# Altium schematic sheet PowerSupply.SchDoc: Power Board
size Tabloid; Date: 12/20/2022; Engineer: Terry D. Schevker; Revision: 1.0; SheetNumber: 5; SheetTotal: 8
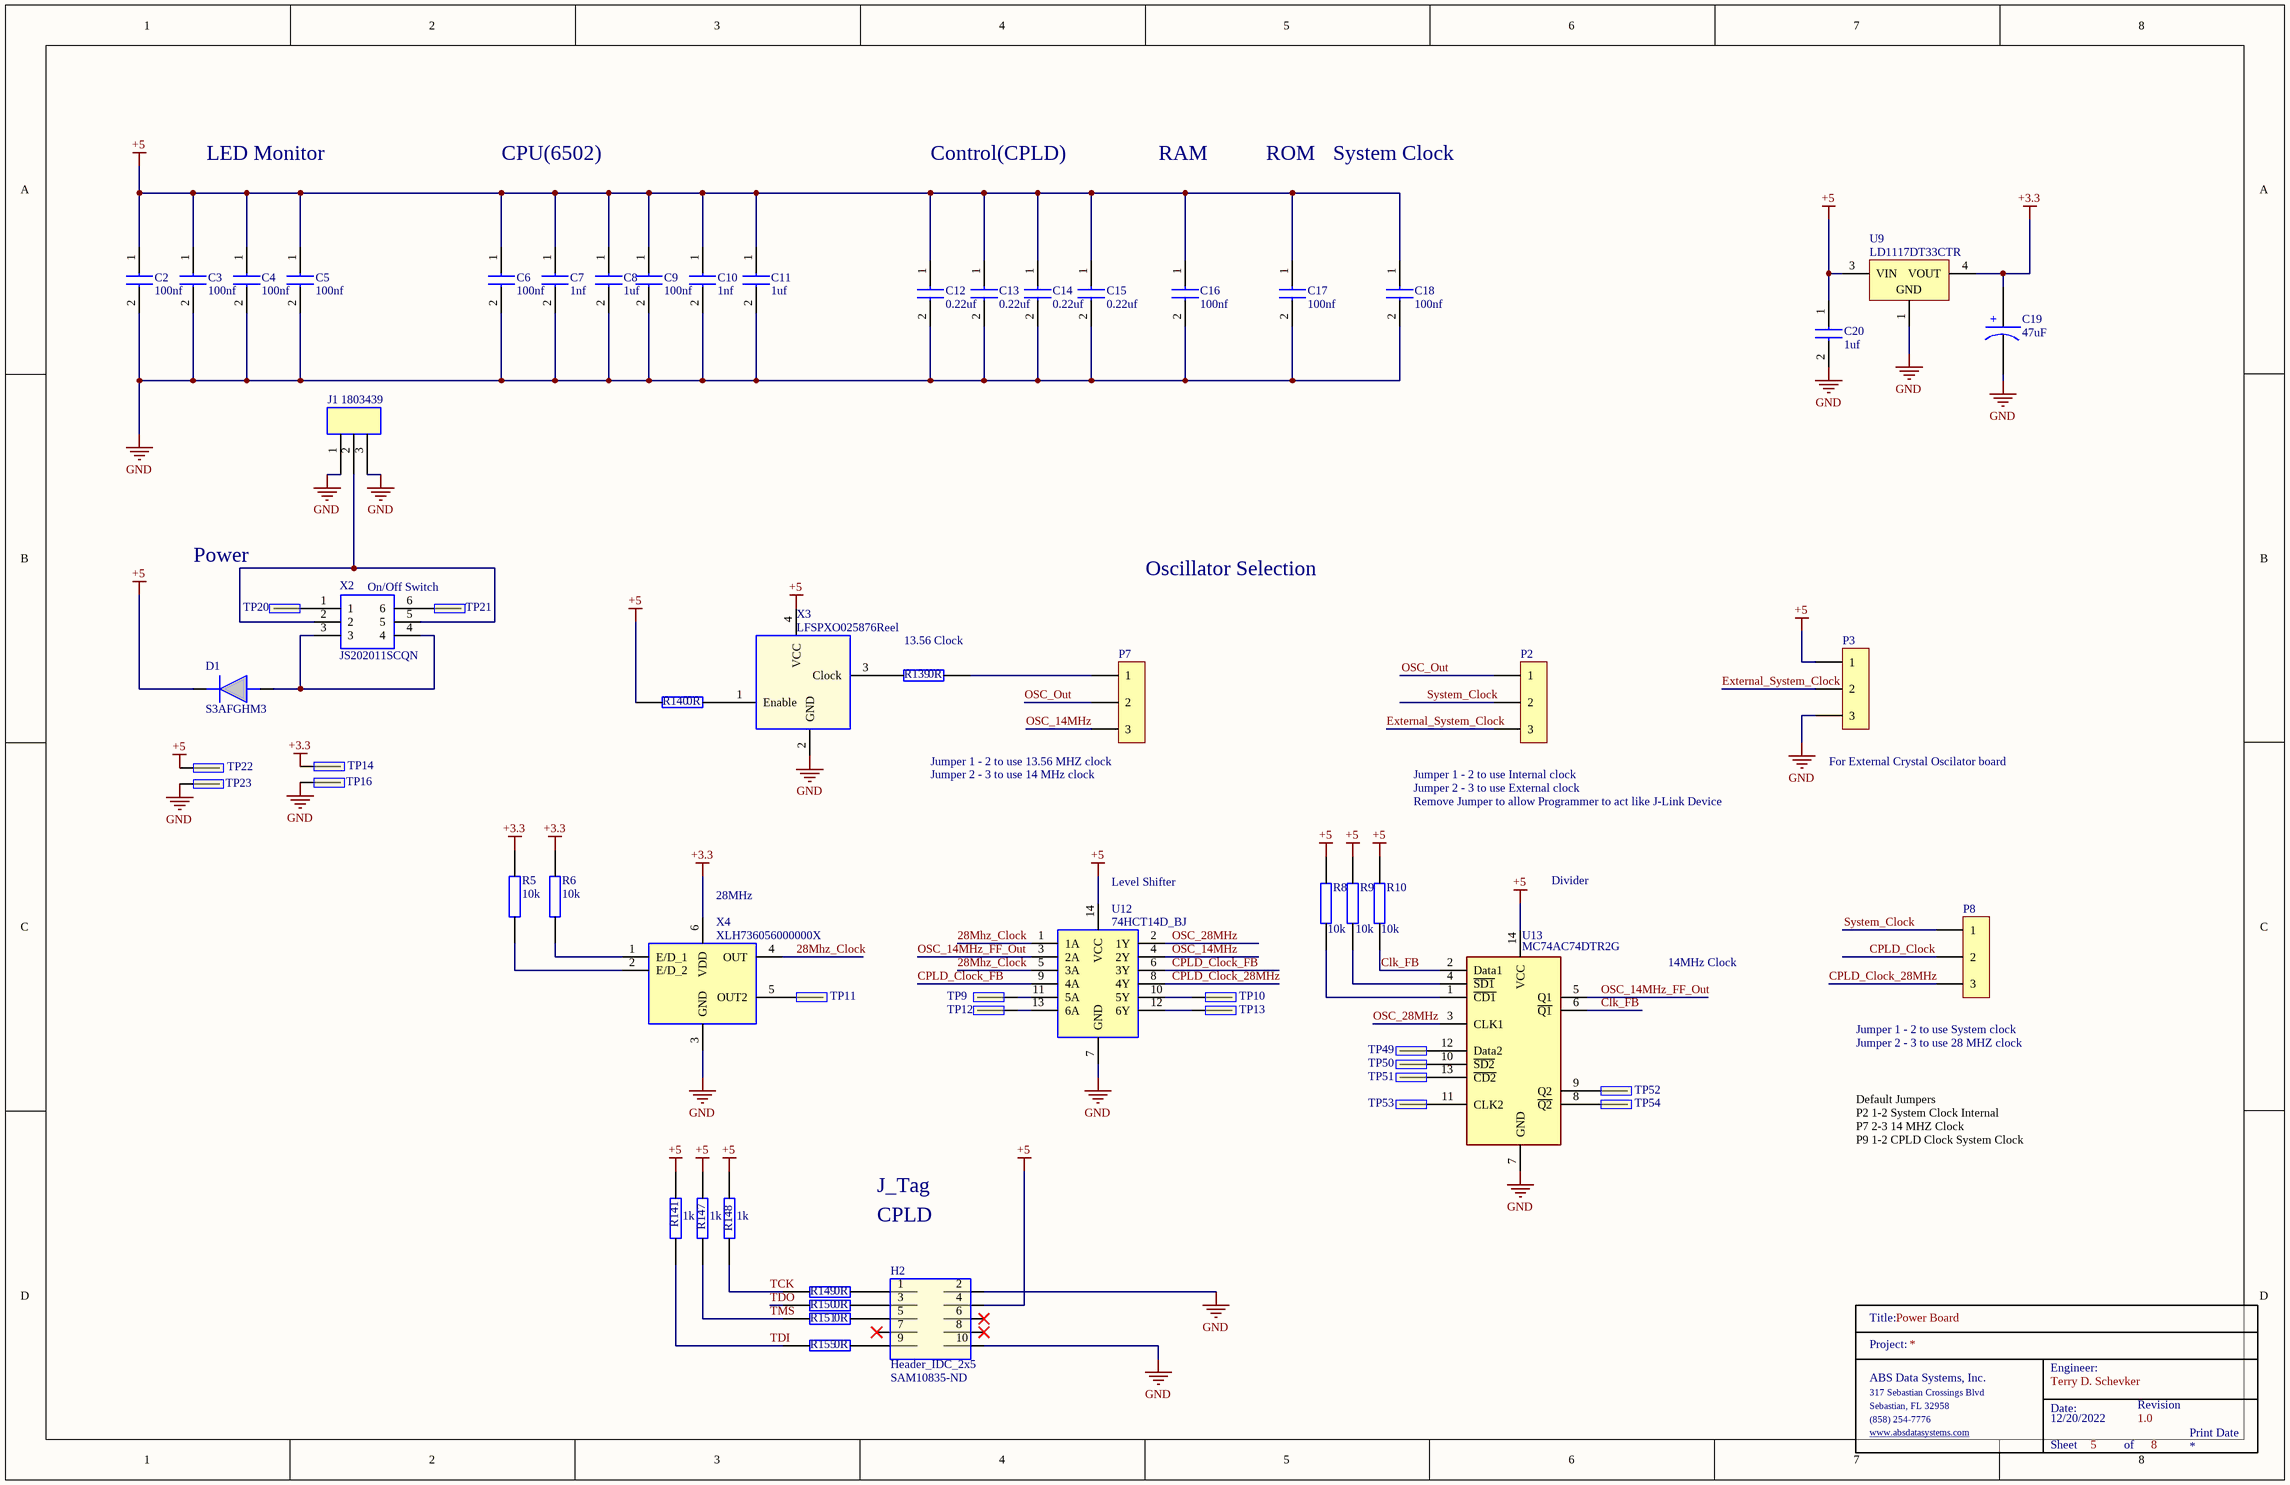
[diagram p0: PowerSupply.SchDoc]

## Parts
C2  100nf  [0603]
C3  100nf  [0603]
C4  100nf  [0603]
C5  100nf  [0603]
C6  100nf  [0603]
C7  1nf  [0603]
C8  1uf  [0603]
C9  100nf  [0603]
C10  1nf  [0603]
C11  1uf  [0603]
C12  0.22uf  [0603]
C13  0.22uf  [0603]
C14  0.22uf  [0603]
C15  0.22uf  [0603]
C16  100nf  [0603]
C17  100nf  [0603]
C18  100nf  [0603]
C19  47uF  [CapSMD_6.3x5.8]
C20  1uf  [0603]
D1  S3AFGHM3  [do-221ac]
H2  Header_IDC_2x5  Supplier Part Number 1: SAM10835-ND  [HDR2X5]
J1  1803439  [1803439]
P2  MHDR1X3_100  [MHDR1X3_100]  (value not drawn)
P3  MHDR1X3_100  [MHDR1X3_100]  (value not drawn)
P7  MHDR1X3_100  [MHDR1X3_100]  (value not drawn)
P8  MHDR1X3_100  [MHDR1X3_100]  (value not drawn)
R5  10k  [0603]
R6  10k  [0603]
R8  10k  [0603]
R9  10k  [0603]
R10  10k  [0603]
R139  0R  [0603]
R140  0R  [0603]
R141  1k  [0603]
R147  1k  [0603]
R148  1k  [0603]
R149  0R  [0603]
R150  0R  [0603]
R151  0R  [0603]
R155  0R  [0603]
TitleBlock_3  TitleBlock  (value not drawn)  (graphical)
TP9  (no value)  [TP]
TP10  TP  [TP]  (value not drawn)
TP11  TP  [TP]  (value not drawn)
TP12  (no value)  [TP]
TP13  TP  [TP]  (value not drawn)
TP14  TP  [TP]  (value not drawn)
TP16  TP  [TP]  (value not drawn)
TP20  (no value)  [TP]
TP21  (no value)  [TP]
TP22  TP  [TP]  (value not drawn)
TP23  TP  [TP]  (value not drawn)
TP49  TP  [TP]  (value not drawn)
TP50  TP  [TP]  (value not drawn)
TP51  TP  [TP]  (value not drawn)
TP52  TP  [TP]  (value not drawn)
TP53  TP  [TP]  (value not drawn)
TP54  TP  [TP]  (value not drawn)
U9  LD1117DT33CTR  [TO-252_N]
U12  74HCT14D_BJ  [SOIC127P600X175-14N]
U13  MC74AC74DTR2G  [SOP65P640X120-14N]
X2  JS202011SCQN  [JS202011SCQN]
X3  LFSPXO025876Reel  [LFSPXO025876Reel]
X4  XLH736056000000X  [XLH736056000000X]

## Nets
+3.3: C19.1 R5.2 R6.2 TP14.1 U9.4(VOUT) X4.6(VDD)
+5: C2.1 C3.1 C4.1 C5.1 C6.1 C7.1 C8.1 C9.1 C10.1 C11.1 C12.1 C13.1 C14.1 C15.1 C16.1 C17.1 C18.1 C20.1 D1.1(K) H2.4 P3.1 R8.2 R9.2 R10.2 R140.1 R141.1 R147.1 R148.1 TP22.1 U9.3(VIN) U12.14(VCC) U13.14(VCC) X3.4(VCC)
GND: C2.2 C3.2 C4.2 C5.2 C6.2 C7.2 C8.2 C9.2 C10.2 C11.2 C12.2 C13.2 C14.2 C15.2 C16.2 C17.2 C18.2 C19.2 C20.2 H2.2 H2.10 J1.1 J1.3 P3.3 TP16.1 TP23.1 U9.1(GND) U12.7(GND) U13.7(GND) X3.2(GND) X4.3(GND)
28Mhz_Clock: U12.1(1A) U12.5(3A) X4.4(OUT)
Clk_FB: R10.1 U13.2(Data1) U13.6(~{Q1})
CPLD_Clock: P8.2
CPLD_Clock_28MHz: P8.3 U12.8(4Y)
CPLD_Clock_FB: U12.6(3Y) U12.9(4A)
External_System_Clock: P2.3 P3.2
OSC_14MHz: P7.3 U12.4(2Y)
OSC_14MHz_FF_Out: U12.3(2A) U13.5(Q1)
OSC_28MHz: U12.2(1Y) U13.3(CLK1)
OSC_Out: P2.1 P7.2
System_Clock: P2.2 P8.1
TCK: R148.2 R149.1
TDI: R141.2 R155.1
TDO: R150.1
TMS: R147.2 R151.1
NetD1_2: D1.2(A) X2.3 X2.4
NetH2_1: H2.1 R149.2
NetH2_3: H2.3 R150.2
NetH2_5: H2.5 R151.2
NetH2_9: H2.9 R155.2
NetJ1_2: J1.2 X2.2 X2.5
NetP7_1: P7.1 R139.2
NetR5_1: R5.1 X4.2(E/D_2)
NetR6_1: R6.1 X4.1(E/D_1)
NetR8_1: R8.1 U13.1(~{CD1})
NetR9_1: R9.1 U13.4(~{SD1})
NetR139_1: R139.1 X3.3(Clock)
NetR140_2: R140.2 X3.1(Enable)
NetTP9_1: TP9.1 U12.11(5A)
NetTP10_1: TP10.1 U12.10(5Y)
NetTP11_1: TP11.1 X4.5(OUT2)
NetTP12_1: TP12.1 U12.13(6A)
NetTP13_1: TP13.1 U12.12(6Y)
NetTP20_1: TP20.1 X2.1
NetTP21_1: TP21.1 X2.6
NetTP49_1: TP49.1 U13.12(Data2)
NetTP50_1: TP50.1 U13.10(~{SD2})
NetTP51_1: TP51.1 U13.13(~{CD2})
NetTP52_1: TP52.1 U13.9(Q2)
NetTP53_1: TP53.1 U13.11(CLK2)
NetTP54_1: TP54.1 U13.8(~{Q2})

Not connected (* = marked no-connect by the designer): H2 6* 7* 8*

## Notes on the sheet
- LED Monitor
- CPU(6502)
- Control(CPLD)
- RAM
- ROM
- System Clock
- (near TP20) Power
- On/Off Switch
- Oscillator Selection
- (near R139) 13.56 Clock
- (near P7) Jumper 1 - 2 to use 13.56 MHZ clock
- (near P3) For External Crystal Oscilator board
- (near P7) Jumper 2 - 3 to use 14 MHz clock
- (near P2) Jumper 1 - 2 to use Internal clock
- Remove Jumper to allow Programmer to act like J-Link Device
- Jumper 2 - 3 to use External clock
- (near X4) 28MHz
- (near U12) Level Shifter
- Divider
- 14MHz Clock
- (near P8) Jumper 1 - 2 to use System clock
- Jumper 2 - 3 to use 28 MHZ clock
- Default Jumpers
  P2 1-2 System Clock Internal
  P7 2-3 14 MHZ Clock
  P9 1-2 CPLD Clock System Clock
- J_Tag
- CPLD
- Print Date
- (in symbol TitleBlock) Title:; Project:; Engineer:; ABS Data Systems, Inc.; 317 Sebastian Crossings Blvd; Sebastian, FL 32958; Date:; Revision; (858) 254-7776; www.absdatasystems.com; Sheet; of
- (in symbol UUD1C470MCL1GS) +

## Library data of the parts
C2-C6 C9 C12-C18 = CL10B104JB8NNNC: Samsung Electro-Mechanics 0603 100nf
C7 C10 = CL10B102KB8NNNL: Samsung Electro-Mechanics 0603 1nf
C8 C11 C20 = CL10B105KA8NNNL: Samsung Electro-Mechanics 0603 1uf
C19 = UUD1C470MCL1GS: CAP ALUM 47UF 20% 16V SMD; Manufacturer: Nichicon; Dielectric Material: Aluminium; Ripple Current: 230mA; Impedance: 440mR; Leakage Current: 3uA; Life (Hours): 2000Hour; Dissipation Factor: 0.2%; Lead Diameter: 0.8mm; Supplier 1: Digi-Key; Manufacturer Part Number: UUD1C470MCL1GS; RoHS: Yes; Category: Aluminum Electrolytic Capacitors; Stock 1: 26327; Pricing 1: 1=0.50000, 10=0.34600, 50=0.24220, 100=0.20760, 500=0.15568 (USD); Case/Package: Radial; Number of Pins: 2; Contact Plating: Tin; Min Operating Temperature: -55°C; Max Operating Temperature: 105°C; Tolerance: 20%; Capacitance: 47uF; Package Quantity: 1000; Voltage Rating (DC): 16V; Packaging: Tape and Reel; Voltage Rating: 16V; Ripple Current (AC): 230mA; Termination: SMD/SMT; Voltage: 16V; Diameter: 6.3mm; Length: 5.8mm; Height: 5.8mm; Lead Pitch: 2.2mm; Height - Seated (Max): 0.228inch; Radiation Hardening: No; REACH SVHC: No SVHC; Lead Free: Lead Free; ComponentLink1URL: https://datasheet.ciiva.com/30522/getdatasheetpartid-449848-30522051.pdf?src-supplier=Verical; ComponentLink1Description: https://datasheet.ciiva.com/30522/getdatasheetpartid-449848-30522051.pdf?src-supplier=Verical; ComponentLink2URL: https://datasheet.ciiva.com/96/e-ud-96997.pdf?src-supplier=Digi-Key; ComponentLink2Description: https://datasheet.ciiva.com/96/e-ud-96997.pdf?src-supplier=Digi-Key; ComponentLink3URL: https://datasheet.ciiva.com/11776/0900766b80fa39e7-11776889.pdf?src-supplier=RSComponents; ComponentLink3Description: https://datasheet.ciiva.com/11776/0900766b80fa39e7-11776889.pdf?src-supplier=RSComponents; ComponentLink4URL: https://datasheet.ciiva.com/96/e-ud-96998.pdf?src-supplier=Digi-Key; ComponentLink4Description: https://datasheet.ciiva.com/96/e-ud-96998.pdf?src-supplier=Digi-Key; ComponentLink5URL: https://datasheet.ciiva.com/96/e-ud-96999.pdf?src-supplier=Digi-Key; ComponentLink5Description: https://datasheet.ciiva.com/96/e-ud-96999.pdf?src-supplier=Digi-Key; ComponentLink6URL: https://datasheet.ciiva.com/11686/e-ud-11686236.pdf?src-supplier=Avnet; ComponentLink6Description: https://datasheet.ciiva.com/11686/e-ud-11686236.pdf?src-supplier=Avnet; ComponentLink7URL: https://datasheet.ciiva.com/16502/e-ud-16502750.pdf?src-supplier=Future+Electronics; ComponentLink7Description: https://datasheet.ciiva.com/16502/e-ud-16502750.pdf?src-supplier=Future+Electronics; ComponentLink8URL: https://datasheet.ciiva.com/7781/e-ud-7781695.pdf?src-supplier=Element14; ComponentLink8Description: https://datasheet.ciiva.com/7781/e-ud-7781695.pdf?src-supplier=Element14; Supplier Part Number 1: 493-2259-1-ND
D1 = S3AFGHM3/I: Rectifiers VR=400V, IO=3A; Manufacturer_Name: Comchip Technology; Manufacturer_Part_Number: 1N4001-G; Mouser Part Number: 750-1N4001-G; Mouser Price/Stock: https://www.mouser.co.uk/ProductDetail/Comchip-Technology/1N4001-G?qs=2qJf6qQ4IOKJYZQUWvVExw%3D%3D; Datasheet Link: https://datasheet.datasheetarchive.com/originals/distributors/Datasheets-7/DSA-138621.pdf
H2 = Header_IDC_2x5: 10 Pin 2x5 Through Hold IDC Connector; Manufacturer: Samtec; Manufacturer Part Number: TST-105-01-G-D; Number of Contacts: 16; Gender: Male; Connector Type: Male Pin; Pitch: 2.54mm; Row Spacing: 0.1inch; Supplier 1: Digi-Key; RoHS: Yes; Category: Headers and Wire Housings; Stock 1: 227; Pricing 1: 1=2.85000, 10=2.73600, 100=2.28000, 500=1.93800, 1000=1.65300, 5000=1.48200 (USD); Mount: Through Hole; Contact Plating: Gold; Contact Material: Bronze; Housing Material: Polyester; Housing Color: Black; Color: Black; Min Operating Temperature: -55°C; Max Operating Temperature: 125°C; Number of Rows: 2; Termination: Solder; Packaging: Rail/Tube; Orientation: Straight; Number of Positions: 16; Length: 27.94mm; Depth: 9.27mm; Contact Mating Length: 0.25inch; REACH SVHC: No SVHC; ComponentLink1URL: https://datasheet.ciiva.com/739/tst-mkt-739845.pdf?src-supplier=Digi-Key; ComponentLink1Description: https://datasheet.ciiva.com/739/tst-mkt-739845.pdf?src-supplier=Digi-Key; ComponentLink2URL: https://datasheet.ciiva.com/10018/htst-10018510.pdf?src-supplier=Avnet; ComponentLink2Description: https://datasheet.ciiva.com/10018/htst-10018510.pdf?src-supplier=Avnet
J1 = 1803439: Connector; Manufacturer_Name: Phoenix Contact; Datasheet Link: http://uk.rs-online.com/web/p/products/2204838; Manufacturer_Part_Number: 1803439; Mouser Part Number: 651-1803439; Mouser Price/Stock: https://www.mouser.co.uk/ProductDetail/Phoenix-Contact/1803439?qs=ChwaSN6Xm4%2FKqu7eZUAe4w%3D%3D; Arrow Part Number: 1803439; Arrow Price/Stock: https://www.arrow.com/en/products/1803439/phoenix-contact?region=nac
P2 P3 P7 P8 = MHDR1X3_100: Header, 3-Pin; LatestRevisionDate: 17-Jul-2002; LatestRevisionNote: Re-released for DXP Platform.; Publisher: Altium Limited
R5 R6 R8-R10 = RC0603JR-0710KL: YAGEO 0603 10k ohm; Manufacturer_Name: KEMET; Manufacturer_Part_Number: RC0603JR-070RL; Geometry.Height: 0.55mm; Mouser Part Number: 603-RC0603JR-070RL; Mouser Price/Stock: https://www.mouser.co.uk/ProductDetail/YAGEO/RC0603JR-070RL?qs=2cAdsCoAWRGWyPcuXgGiXQ%3D%3D; Datasheet Link: https://datasheet.datasheetarchive.com/originals/distributors/Datasheets_SAMA/902f9e387b938f871d31120f5fc1d65e.pdf
R139 R140 R149-R151 R155 = RC0603JR-070RL: YAGEO 0603 0 ohm; Manufacturer_Name: KEMET; Geometry.Height: 0.55mm; Mouser Part Number: 603-RC0603JR-070RL; Mouser Price/Stock: https://www.mouser.co.uk/ProductDetail/YAGEO/RC0603JR-070RL?qs=2cAdsCoAWRGWyPcuXgGiXQ%3D%3D; Manufacturer_Part_Number: RC0603JR-070RL; Datasheet Link: https://datasheet.datasheetarchive.com/originals/distributors/Datasheets_SAMA/902f9e387b938f871d31120f5fc1d65e.pdf
R141 R147 R148 = AC0603FR-7W1KL: YAGEO 0603 1k ohm; Manufacturer_Name: KEMET; Manufacturer_Part_Number: RC0603JR-070RL; Geometry.Height: 0.55mm; Mouser Part Number: 603-RC0603JR-070RL; Mouser Price/Stock: https://www.mouser.co.uk/ProductDetail/YAGEO/RC0603JR-070RL?qs=2cAdsCoAWRGWyPcuXgGiXQ%3D%3D; Datasheet Link: https://datasheet.datasheetarchive.com/originals/distributors/Datasheets_SAMA/902f9e387b938f871d31120f5fc1d65e.pdf
TP9-TP14 TP16 TP20-TP23 TP49-TP54 = TP: Manufacturer: Samtec; Manufacturer Part Number: TST-105-01-G-D; Number of Contacts: 16; Gender: Male; Connector Type: Male Pin; Pitch: 2.54mm; Row Spacing: 0.1inch; Supplier 1: Digi-Key; RoHS: Yes; Category: Headers and Wire Housings; Stock 1: 227; Pricing 1: 1=2.85000, 10=2.73600, 100=2.28000, 500=1.93800, 1000=1.65300, 5000=1.48200 (USD); Mount: Through Hole; Contact Plating: Gold; Contact Material: Bronze; Housing Material: Polyester; Housing Color: Black; Color: Black; Min Operating Temperature: -55°C; Max Operating Temperature: 125°C; Number of Rows: 2; Termination: Solder; Packaging: Rail/Tube; Orientation: Straight; Number of Positions: 16; Length: 27.94mm; Depth: 9.27mm; Contact Mating Length: 0.25inch; REACH SVHC: No SVHC; ComponentLink1URL: https://datasheet.ciiva.com/739/tst-mkt-739845.pdf?src-supplier=Digi-Key; ComponentLink1Description: https://datasheet.ciiva.com/739/tst-mkt-739845.pdf?src-supplier=Digi-Key; ComponentLink2URL: https://datasheet.ciiva.com/10018/htst-10018510.pdf?src-supplier=Avnet; ComponentLink2Description: https://datasheet.ciiva.com/10018/htst-10018510.pdf?src-supplier=Avnet
U9 = PM-REG-LD1117-SOT3: 3.3V Voltage Regulator SMD; PackageVersion: 2011; ComponentLink1URL: http://www.st.com; DatasheetVersion: 1/11/2011; PackageReference: TO-252; ComponentLink1Description: Manufacturer URL; ComponentLink2URL: http://www.st.com/internet/com/TECHNICAL_RESOURCES/TECHNICAL_LITERATURE/DATASHEET/CD00000544.pdf; ComponentLink2Description: Datasheet; PackageDescription: 3-Pin Transistor Outline Package 2.28 mm Pitch, 9.7 mm Lead Span (DPAK)
U12 = 74HCT14D_BJ: Inveter
U13 = MC74AC74DTR2G: FlipFlop
X2 = JS202011SCQN: Sub miniature slide switches; Manufacturer_Name: C & K COMPONENTS; Geometry.Height: 5.5mm; Mouser Part Number: 611-JS202011SCQN; Mouser Price/Stock: https://www.mouser.co.uk/ProductDetail/CK/JS202011SCQN?qs=LgMIjt8LuD95JYWxZ7NvZA%3D%3D; Manufacturer_Part_Number: JS202011SCQN; Datasheet Link: http://www.ckswitches.com/media/1422/js.pdf
X3 = LFSPXO025876Reel: Standard Clock Oscillators 13.56MHz 5V 100ppm -40C +85C; Manufacturer_Name: IQD; Geometry.Height: 1.4mm; Mouser Part Number: 449-LFSPXO025876REEL; Mouser Price/Stock: https://www.mouser.co.uk/ProductDetail/IQD/LFSPXO025876Reel?qs=e4%2FAndAAwgKQk%252Bo7MiilFg%3D%3D; Manufacturer_Part_Number: LFSPXO025876Reel; Datasheet Link: https://componentsearchengine.com/Datasheets/1/LFSPXO025876Reel.pdf
X4 = XLH736056000000X: Crystall Oscillator